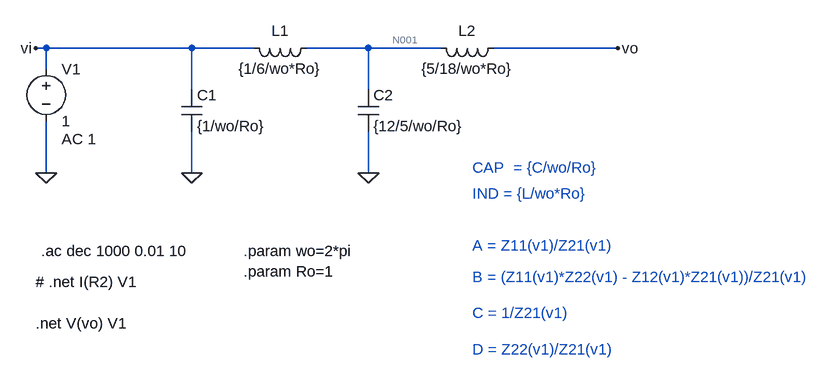
[diagram p0: schematic ej1bCuadripolos.asc]
ej1bCuadripolos.asc, the LTspice schematic file:
Version 4.1
SHEET 1 980 680
WIRE -272 80 -288 80
WIRE -48 80 -272 80
WIRE 48 80 -48 80
WIRE 224 80 128 80
WIRE 336 80 224 80
WIRE 608 80 416 80
WIRE -272 112 -272 80
WIRE -48 144 -48 80
WIRE 224 144 224 80
WIRE -272 272 -272 192
WIRE -48 272 -48 208
WIRE 224 272 224 208
FLAG -288 80 vi
FLAG -48 272 0
FLAG 608 80 vo
FLAG -272 272 0
FLAG 224 272 0
SYMBOL voltage -272 96 R0
WINDOW 123 24 124 Left 2
WINDOW 39 0 0 Left 0
SYMATTR Value2 AC 1
SYMATTR InstName V1
SYMATTR Value 1
SYMBOL cap -64 144 R0
SYMATTR InstName C1
SYMATTR Value {1/wo/Ro}
SYMBOL cap 208 144 R0
SYMATTR InstName C2
SYMATTR Value {12/5/wo/Ro}
SYMBOL ind 144 64 R90
WINDOW 0 5 56 VBottom 2
WINDOW 3 32 56 VTop 2
SYMATTR InstName L1
SYMATTR Value {1/6/wo*Ro}
SYMATTR SpiceLine Rser=1m
SYMBOL ind 432 64 R90
WINDOW 0 5 56 VBottom 2
WINDOW 3 32 56 VTop 2
SYMATTR InstName L2
SYMATTR Value {5/18/wo*Ro}
SYMATTR SpiceLine Rser=1m
TEXT -280 392 Left 2 !.ac dec 1000 0.01 10
TEXT -288 440 Left 2 !# .net I(R2) V1
TEXT -288 504 Left 2 !.net V(vo) V1
TEXT 32 392 Left 2 !.param wo=2*pi
TEXT 32 424 Left 2 !.param Ro=1
TEXT 384 384 Left 2 ;A = Z11(v1)/Z21(v1)
TEXT 384 432 Left 2 ;B = (Z11(v1)*Z22(v1) - Z12(v1)*Z21(v1))/Z21(v1)
TEXT 384 488 Left 2 ;C = 1/Z21(v1)
TEXT 384 544 Left 2 ;D = Z22(v1)/Z21(v1)
TEXT 384 264 Left 2 ;CAP  = {C/wo/Ro}
TEXT 384 304 Left 2 ;IND = {L/wo*Ro}

The netlist it stands for:
* ej1bCuadripolos.asc
V1 vi 0 1 AC 1
C1 vi 0 {1/wo/Ro}
C2 N001 0 {12/5/wo/Ro}
L1 N001 vi {1/6/wo*Ro} Rser=1m
L2 vo N001 {5/18/wo*Ro} Rser=1m
.ac dec 1000 0.01 10
# .net I(R2) V1
.net V(vo) V1
.param wo=2*pi
.param Ro=1
* A = Z11(v1)/Z21(v1)
* B = (Z11(v1)*Z22(v1) - Z12(v1)*Z21(v1))/Z21(v1)
* C = 1/Z21(v1)
* D = Z22(v1)/Z21(v1)
* CAP  = {C/wo/Ro}
* IND = {L/wo*Ro}
.backanno
.end

* Results of the author's LTspice run, read from the files saved beside the schematic
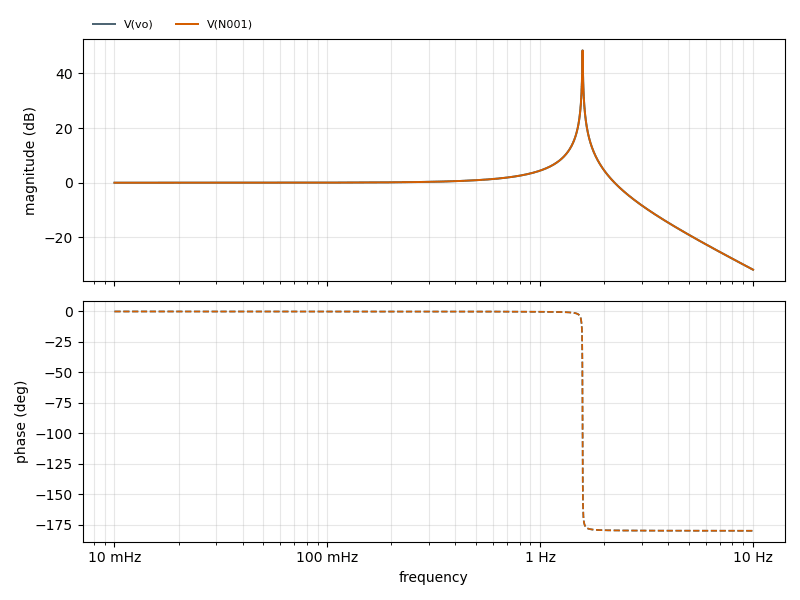
[diagram p1: AC Analysis of ej1bCuadripolos.asc, plotted from the saved traces]
* AC Analysis, 1 run:
*   V(vo): 0.00 dB at 10 mHz, -31.82 dB at 10 Hz, peak 48.41 dB at 1.581 Hz, 3 dB below the peak at 1.578 Hz and 1.584 Hz
*   V(N001): 0.00 dB at 10 mHz, -31.82 dB at 10 Hz, peak 48.41 dB at 1.581 Hz, 3 dB below the peak at 1.578 Hz and 1.584 Hz